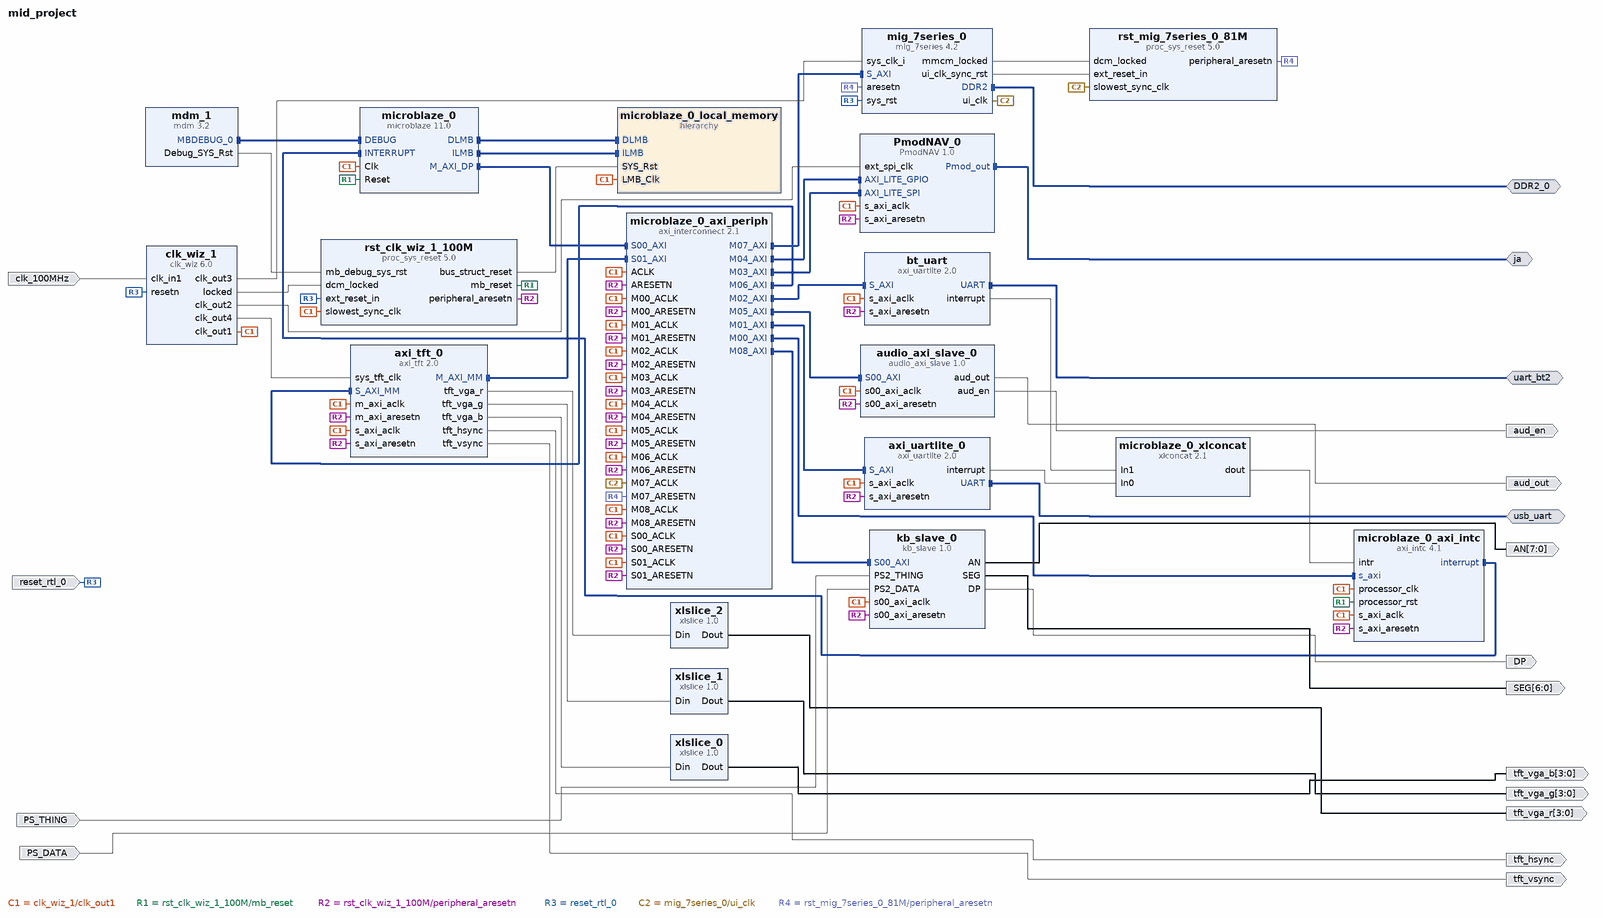
[diagram p0: block diagram of the top level]
# Vivado block design mid_project, xc7a100tcsg324-1, Vivado 2018.3
create_bd_design mid_project

create_bd_intf_port -mode Master -vlnv xilinx.com:interface:uart_rtl:1.0 usb_uart
create_bd_intf_port -mode Master -vlnv digilentinc.com:interface:pmod_rtl:1.0 ja
create_bd_intf_port -mode Master -vlnv xilinx.com:interface:uart_rtl:1.0 uart_bt2
create_bd_intf_port -mode Master -vlnv xilinx.com:interface:ddrx_rtl:1.0 DDR2_0
create_bd_port -dir I -type rst reset_rtl_0
set_property -dict {CONFIG.POLARITY ACTIVE_LOW} [get_bd_ports reset_rtl_0]
create_bd_port -dir I -type clk clk_100MHz
set_property -dict {CONFIG.FREQ_HZ 100000000 CONFIG.PHASE 0.000} [get_bd_ports clk_100MHz]
create_bd_port -dir O aud_out
create_bd_port -dir O aud_en
create_bd_port -dir O -from 3 -to 0 tft_vga_b
create_bd_port -dir O -from 3 -to 0 tft_vga_g
create_bd_port -dir O -from 3 -to 0 tft_vga_r
create_bd_port -dir O tft_hsync
create_bd_port -dir O tft_vsync
create_bd_port -dir I PS_THING
create_bd_port -dir I PS_DATA
create_bd_port -dir O -from 6 -to 0 SEG
create_bd_port -dir O -from 7 -to 0 AN
create_bd_port -dir O DP

create_bd_cell -type ip -vlnv xilinx.com:ip:microblaze:11.0 microblaze_0
set_property -dict {CONFIG.C_DEBUG_ENABLED 1 CONFIG.C_D_AXI 1 CONFIG.C_D_LMB 1 CONFIG.C_I_LMB 1} [get_bd_cells microblaze_0]
create_bd_cell -type hier microblaze_0_local_memory
create_bd_cell -type ip -vlnv xilinx.com:ip:axi_interconnect:2.1 microblaze_0_axi_periph
set_property -dict [list \
  CONFIG.M06_HAS_REGSLICE 3 \
  CONFIG.NUM_MI 9 \
  CONFIG.NUM_SI 2 \
  CONFIG.S00_HAS_REGSLICE 3 \
] [get_bd_cells microblaze_0_axi_periph]
create_bd_cell -type ip -vlnv xilinx.com:ip:axi_intc:4.1 microblaze_0_axi_intc
set_property -dict {CONFIG.C_HAS_FAST 1} [get_bd_cells microblaze_0_axi_intc]
create_bd_cell -type ip -vlnv xilinx.com:ip:xlconcat:2.1 microblaze_0_xlconcat
create_bd_cell -type ip -vlnv xilinx.com:ip:mdm:3.2 mdm_1
create_bd_cell -type ip -vlnv xilinx.com:ip:clk_wiz:6.0 clk_wiz_1
set_property -dict [list \
  CONFIG.CLKOUT2_JITTER 151.636 \
  CONFIG.CLKOUT2_PHASE_ERROR 98.575 \
  CONFIG.CLKOUT2_REQUESTED_OUT_FREQ 50 \
  CONFIG.CLKOUT2_USED true \
  CONFIG.CLKOUT3_JITTER 114.829 \
  CONFIG.CLKOUT3_PHASE_ERROR 98.575 \
  CONFIG.CLKOUT3_REQUESTED_OUT_FREQ 200 \
  CONFIG.CLKOUT3_USED true \
  CONFIG.CLKOUT4_JITTER 175.402 \
  CONFIG.CLKOUT4_PHASE_ERROR 98.575 \
  CONFIG.CLKOUT4_REQUESTED_OUT_FREQ 25 \
  CONFIG.CLKOUT4_USED true \
  CONFIG.CLK_IN1_BOARD_INTERFACE sys_clock \
  CONFIG.MMCM_CLKOUT1_DIVIDE 20 \
  CONFIG.MMCM_CLKOUT2_DIVIDE 5 \
  CONFIG.MMCM_CLKOUT3_DIVIDE 40 \
  CONFIG.MMCM_DIVCLK_DIVIDE 1 \
  CONFIG.NUM_OUT_CLKS 4 \
  CONFIG.PRIM_SOURCE Single_ended_clock_capable_pin \
  CONFIG.RESET_BOARD_INTERFACE reset \
  CONFIG.RESET_PORT resetn \
  CONFIG.RESET_TYPE ACTIVE_LOW \
  CONFIG.USE_BOARD_FLOW true \
] [get_bd_cells clk_wiz_1]
create_bd_cell -type ip -vlnv xilinx.com:ip:proc_sys_reset:5.0 rst_clk_wiz_1_100M
set_property -dict {CONFIG.RESET_BOARD_INTERFACE reset CONFIG.USE_BOARD_FLOW true} [get_bd_cells rst_clk_wiz_1_100M]
create_bd_cell -type ip -vlnv xilinx.com:ip:axi_uartlite:2.0 axi_uartlite_0
set_property -dict {CONFIG.UARTLITE_BOARD_INTERFACE usb_uart CONFIG.USE_BOARD_FLOW true} [get_bd_cells axi_uartlite_0]
create_bd_cell -type ip -vlnv digilentinc.com:IP:PmodNAV:1.0 PmodNAV_0
set_property -dict {CONFIG.PMOD ja CONFIG.USE_BOARD_FLOW true} [get_bd_cells PmodNAV_0]
create_bd_cell -type ip -vlnv xilinx.com:ip:axi_uartlite:2.0 bt_uart
set_property -dict {CONFIG.C_BAUDRATE 115200} [get_bd_cells bt_uart]
create_bd_cell -type ip -vlnv xilinx.com:ip:axi_tft:2.0 axi_tft_0
set_property -dict {CONFIG.C_EN_I2C_INTF 0 CONFIG.C_TFT_INTERFACE 0} [get_bd_cells axi_tft_0]
create_bd_cell -type ip -vlnv xilinx.com:ip:xlslice:1.0 xlslice_0
set_property -dict {CONFIG.DIN_FROM 5 CONFIG.DIN_TO 2 CONFIG.DIN_WIDTH 6 CONFIG.DOUT_WIDTH 4} [get_bd_cells xlslice_0]
create_bd_cell -type ip -vlnv xilinx.com:ip:xlslice:1.0 xlslice_1
set_property -dict {CONFIG.DIN_FROM 5 CONFIG.DIN_TO 2 CONFIG.DIN_WIDTH 6 CONFIG.DOUT_WIDTH 1} [get_bd_cells xlslice_1]
create_bd_cell -type ip -vlnv xilinx.com:ip:xlslice:1.0 xlslice_2
set_property -dict {CONFIG.DIN_FROM 5 CONFIG.DIN_TO 2 CONFIG.DIN_WIDTH 6 CONFIG.DOUT_WIDTH 1} [get_bd_cells xlslice_2]
create_bd_cell -type ip -vlnv xilinx.com:ip:mig_7series:4.2 mig_7series_0
create_bd_cell -type ip -vlnv xilinx.com:ip:proc_sys_reset:5.0 rst_mig_7series_0_81M
create_bd_cell -type ip -vlnv xilinx.com:user:kb_slave:1.0 kb_slave_0
create_bd_cell -type ip -vlnv utoronto.ca:user:audio_axi_slave:1.0 audio_axi_slave_0

# ---- hierarchy /microblaze_0_local_memory ----
current_bd_instance /microblaze_0_local_memory
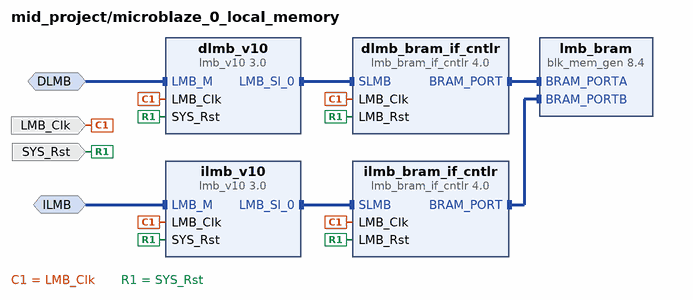
[diagram p1: block diagram inside /microblaze_0_local_memory]
create_bd_intf_pin -mode MirroredMaster -vlnv xilinx.com:interface:lmb_rtl:1.0 DLMB
create_bd_intf_pin -mode MirroredMaster -vlnv xilinx.com:interface:lmb_rtl:1.0 ILMB
create_bd_pin -dir I -type clk LMB_Clk
create_bd_pin -dir I -type rst SYS_Rst

create_bd_cell -type ip -vlnv xilinx.com:ip:lmb_v10:3.0 dlmb_v10
create_bd_cell -type ip -vlnv xilinx.com:ip:lmb_v10:3.0 ilmb_v10
create_bd_cell -type ip -vlnv xilinx.com:ip:lmb_bram_if_cntlr:4.0 dlmb_bram_if_cntlr
set_property -dict {CONFIG.C_ECC 0} [get_bd_cells dlmb_bram_if_cntlr]
create_bd_cell -type ip -vlnv xilinx.com:ip:lmb_bram_if_cntlr:4.0 ilmb_bram_if_cntlr
set_property -dict {CONFIG.C_ECC 0} [get_bd_cells ilmb_bram_if_cntlr]
create_bd_cell -type ip -vlnv xilinx.com:ip:blk_mem_gen:8.4 lmb_bram
set_property -dict {CONFIG.Memory_Type True_Dual_Port_RAM CONFIG.use_bram_block BRAM_Controller} [get_bd_cells lmb_bram]

# ---- connections ----

current_bd_instance /microblaze_0_local_memory
connect_bd_intf_net -intf_net microblaze_0_ilmb_bus [get_bd_intf_pins ilmb_v10/LMB_Sl_0] [get_bd_intf_pins ilmb_bram_if_cntlr/SLMB]
connect_bd_intf_net -intf_net microblaze_0_ilmb [get_bd_intf_pins ILMB] [get_bd_intf_pins ilmb_v10/LMB_M]
connect_bd_intf_net -intf_net microblaze_0_dlmb [get_bd_intf_pins DLMB] [get_bd_intf_pins dlmb_v10/LMB_M]
connect_bd_intf_net -intf_net microblaze_0_dlmb_cntlr [get_bd_intf_pins dlmb_bram_if_cntlr/BRAM_PORT] [get_bd_intf_pins lmb_bram/BRAM_PORTA]
connect_bd_intf_net -intf_net microblaze_0_dlmb_bus [get_bd_intf_pins dlmb_v10/LMB_Sl_0] [get_bd_intf_pins dlmb_bram_if_cntlr/SLMB]
connect_bd_intf_net -intf_net microblaze_0_ilmb_cntlr [get_bd_intf_pins ilmb_bram_if_cntlr/BRAM_PORT] [get_bd_intf_pins lmb_bram/BRAM_PORTB]
connect_bd_net -net microblaze_0_Clk [get_bd_pins LMB_Clk] \
  [get_bd_pins dlmb_v10/LMB_Clk] [get_bd_pins dlmb_bram_if_cntlr/LMB_Clk] [get_bd_pins ilmb_v10/LMB_Clk] \
  [get_bd_pins ilmb_bram_if_cntlr/LMB_Clk]
connect_bd_net [get_bd_pins SYS_Rst] \
  [get_bd_pins dlmb_v10/SYS_Rst] [get_bd_pins dlmb_bram_if_cntlr/LMB_Rst] [get_bd_pins ilmb_v10/SYS_Rst] \
  [get_bd_pins ilmb_bram_if_cntlr/LMB_Rst]
set_property HDL_ATTRIBUTE.BMM_INFO_ADDRESS_SPACE {byte  0x00000000 32 > mid_project microblaze_0_local_memory/lmb_bram} [get_bd_cells dlmb_bram_if_cntlr]
set_property HDL_ATTRIBUTE.KEEP_HIERARCHY yes [get_bd_cells dlmb_bram_if_cntlr]

current_bd_instance /
connect_bd_intf_net [get_bd_intf_pins microblaze_0_axi_periph/M02_AXI] [get_bd_intf_pins bt_uart/S_AXI]
connect_bd_intf_net [get_bd_intf_pins microblaze_0_axi_periph/M04_AXI] [get_bd_intf_pins PmodNAV_0/AXI_LITE_GPIO]
connect_bd_intf_net [get_bd_intf_pins axi_tft_0/M_AXI_MM] [get_bd_intf_pins microblaze_0_axi_periph/S01_AXI]
connect_bd_intf_net [get_bd_intf_pins microblaze_0_axi_periph/M05_AXI] [get_bd_intf_pins audio_axi_slave_0/S00_AXI]
connect_bd_intf_net -intf_net microblaze_0_intc_axi [get_bd_intf_pins microblaze_0_axi_periph/M00_AXI] [get_bd_intf_pins microblaze_0_axi_intc/s_axi]
connect_bd_intf_net [get_bd_intf_ports uart_bt2] [get_bd_intf_pins bt_uart/UART]
connect_bd_intf_net [get_bd_intf_pins microblaze_0/DLMB] [get_bd_intf_pins microblaze_0_local_memory/DLMB]
connect_bd_intf_net [get_bd_intf_pins mdm_1/MBDEBUG_0] [get_bd_intf_pins microblaze_0/DEBUG]
connect_bd_intf_net [get_bd_intf_ports usb_uart] [get_bd_intf_pins axi_uartlite_0/UART]
connect_bd_intf_net [get_bd_intf_pins microblaze_0/ILMB] [get_bd_intf_pins microblaze_0_local_memory/ILMB]
connect_bd_intf_net [get_bd_intf_pins microblaze_0_axi_periph/M03_AXI] [get_bd_intf_pins PmodNAV_0/AXI_LITE_SPI]
connect_bd_intf_net [get_bd_intf_pins microblaze_0_axi_periph/M08_AXI] [get_bd_intf_pins kb_slave_0/S00_AXI]
connect_bd_intf_net -intf_net microblaze_0_axi_dp [get_bd_intf_pins microblaze_0_axi_periph/S00_AXI] [get_bd_intf_pins microblaze_0/M_AXI_DP]
connect_bd_intf_net [get_bd_intf_pins microblaze_0_axi_periph/M01_AXI] [get_bd_intf_pins axi_uartlite_0/S_AXI]
connect_bd_intf_net [get_bd_intf_pins microblaze_0_axi_periph/M06_AXI] [get_bd_intf_pins axi_tft_0/S_AXI_MM]
connect_bd_intf_net [get_bd_intf_ports ja] [get_bd_intf_pins PmodNAV_0/Pmod_out]
connect_bd_intf_net [get_bd_intf_pins microblaze_0_axi_intc/interrupt] [get_bd_intf_pins microblaze_0/INTERRUPT]
connect_bd_intf_net [get_bd_intf_pins microblaze_0_axi_periph/M07_AXI] [get_bd_intf_pins mig_7series_0/S_AXI]
connect_bd_intf_net [get_bd_intf_ports DDR2_0] [get_bd_intf_pins mig_7series_0/DDR2]
connect_bd_net -net microblaze_0_intr [get_bd_pins microblaze_0_xlconcat/dout] [get_bd_pins microblaze_0_axi_intc/intr]
connect_bd_net -net microblaze_0_Clk [get_bd_pins clk_wiz_1/clk_out1] \
  [get_bd_pins microblaze_0/Clk] [get_bd_pins microblaze_0_axi_periph/ACLK] [get_bd_pins microblaze_0_axi_periph/S00_ACLK] \
  [get_bd_pins microblaze_0_axi_periph/M00_ACLK] [get_bd_pins microblaze_0_axi_intc/s_axi_aclk] \
  [get_bd_pins microblaze_0_axi_intc/processor_clk] [get_bd_pins microblaze_0_local_memory/LMB_Clk] \
  [get_bd_pins rst_clk_wiz_1_100M/slowest_sync_clk] [get_bd_pins axi_uartlite_0/s_axi_aclk] \
  [get_bd_pins microblaze_0_axi_periph/M01_ACLK] [get_bd_pins microblaze_0_axi_periph/M02_ACLK] \
  [get_bd_pins PmodNAV_0/s_axi_aclk] [get_bd_pins microblaze_0_axi_periph/M03_ACLK] \
  [get_bd_pins microblaze_0_axi_periph/M04_ACLK] [get_bd_pins bt_uart/s_axi_aclk] \
  [get_bd_pins microblaze_0_axi_periph/M05_ACLK] [get_bd_pins axi_tft_0/m_axi_aclk] [get_bd_pins axi_tft_0/s_axi_aclk] \
  [get_bd_pins microblaze_0_axi_periph/M06_ACLK] [get_bd_pins microblaze_0_axi_periph/S01_ACLK] \
  [get_bd_pins microblaze_0_axi_periph/M08_ACLK] [get_bd_pins kb_slave_0/s00_axi_aclk] \
  [get_bd_pins audio_axi_slave_0/s00_axi_aclk]
connect_bd_net [get_bd_pins clk_wiz_1/locked] [get_bd_pins rst_clk_wiz_1_100M/dcm_locked]
connect_bd_net [get_bd_pins rst_clk_wiz_1_100M/mb_reset] [get_bd_pins microblaze_0/Reset] [get_bd_pins microblaze_0_axi_intc/processor_rst]
connect_bd_net [get_bd_pins rst_clk_wiz_1_100M/bus_struct_reset] [get_bd_pins microblaze_0_local_memory/SYS_Rst]
connect_bd_net [get_bd_pins rst_clk_wiz_1_100M/peripheral_aresetn] \
  [get_bd_pins microblaze_0_axi_periph/ARESETN] [get_bd_pins microblaze_0_axi_periph/S00_ARESETN] \
  [get_bd_pins microblaze_0_axi_periph/M00_ARESETN] [get_bd_pins microblaze_0_axi_intc/s_axi_aresetn] \
  [get_bd_pins axi_uartlite_0/s_axi_aresetn] [get_bd_pins microblaze_0_axi_periph/M01_ARESETN] \
  [get_bd_pins microblaze_0_axi_periph/M02_ARESETN] [get_bd_pins PmodNAV_0/s_axi_aresetn] \
  [get_bd_pins microblaze_0_axi_periph/M03_ARESETN] [get_bd_pins microblaze_0_axi_periph/M04_ARESETN] \
  [get_bd_pins bt_uart/s_axi_aresetn] [get_bd_pins microblaze_0_axi_periph/M05_ARESETN] [get_bd_pins axi_tft_0/m_axi_aresetn] \
  [get_bd_pins axi_tft_0/s_axi_aresetn] [get_bd_pins microblaze_0_axi_periph/M06_ARESETN] \
  [get_bd_pins microblaze_0_axi_periph/S01_ARESETN] [get_bd_pins microblaze_0_axi_periph/M08_ARESETN] \
  [get_bd_pins kb_slave_0/s00_axi_aresetn] [get_bd_pins audio_axi_slave_0/s00_axi_aresetn]
connect_bd_net [get_bd_pins mdm_1/Debug_SYS_Rst] [get_bd_pins rst_clk_wiz_1_100M/mb_debug_sys_rst]
connect_bd_net -net sys_clock_1 [get_bd_ports clk_100MHz] [get_bd_pins clk_wiz_1/clk_in1]
connect_bd_net [get_bd_pins axi_uartlite_0/interrupt] [get_bd_pins microblaze_0_xlconcat/In0]
connect_bd_net [get_bd_pins clk_wiz_1/clk_out2] [get_bd_pins PmodNAV_0/ext_spi_clk]
connect_bd_net [get_bd_pins bt_uart/interrupt] [get_bd_pins microblaze_0_xlconcat/In1]
connect_bd_net [get_bd_pins audio_axi_slave_0/aud_out] [get_bd_ports aud_out]
connect_bd_net [get_bd_pins audio_axi_slave_0/aud_en] [get_bd_ports aud_en]
connect_bd_net [get_bd_pins xlslice_0/Dout] [get_bd_ports tft_vga_b]
connect_bd_net [get_bd_pins xlslice_1/Dout] [get_bd_ports tft_vga_g]
connect_bd_net [get_bd_pins axi_tft_0/tft_vga_b] [get_bd_pins xlslice_0/Din]
connect_bd_net [get_bd_pins axi_tft_0/tft_vga_g] [get_bd_pins xlslice_1/Din]
connect_bd_net [get_bd_pins axi_tft_0/tft_vga_r] [get_bd_pins xlslice_2/Din]
connect_bd_net [get_bd_pins xlslice_2/Dout] [get_bd_ports tft_vga_r]
connect_bd_net [get_bd_pins axi_tft_0/tft_hsync] [get_bd_ports tft_hsync]
connect_bd_net [get_bd_pins axi_tft_0/tft_vsync] [get_bd_ports tft_vsync]
connect_bd_net [get_bd_pins clk_wiz_1/clk_out4] [get_bd_pins axi_tft_0/sys_tft_clk]
connect_bd_net -net reset_1 [get_bd_ports reset_rtl_0] \
  [get_bd_pins clk_wiz_1/resetn] [get_bd_pins rst_clk_wiz_1_100M/ext_reset_in] [get_bd_pins mig_7series_0/sys_rst]
connect_bd_net [get_bd_pins clk_wiz_1/clk_out3] [get_bd_pins mig_7series_0/sys_clk_i]
connect_bd_net [get_bd_pins mig_7series_0/ui_clk] [get_bd_pins microblaze_0_axi_periph/M07_ACLK] [get_bd_pins rst_mig_7series_0_81M/slowest_sync_clk]
connect_bd_net [get_bd_pins mig_7series_0/mmcm_locked] [get_bd_pins rst_mig_7series_0_81M/dcm_locked]
connect_bd_net [get_bd_pins mig_7series_0/ui_clk_sync_rst] [get_bd_pins rst_mig_7series_0_81M/ext_reset_in]
connect_bd_net [get_bd_pins rst_mig_7series_0_81M/peripheral_aresetn] \
  [get_bd_pins mig_7series_0/aresetn] [get_bd_pins microblaze_0_axi_periph/M07_ARESETN]
connect_bd_net [get_bd_ports PS_THING] [get_bd_pins kb_slave_0/PS2_THING]
connect_bd_net [get_bd_ports PS_DATA] [get_bd_pins kb_slave_0/PS2_DATA]
connect_bd_net [get_bd_pins kb_slave_0/SEG] [get_bd_ports SEG]
connect_bd_net [get_bd_pins kb_slave_0/AN] [get_bd_ports AN]
connect_bd_net [get_bd_pins kb_slave_0/DP] [get_bd_ports DP]
set_property HDL_ATTRIBUTE.BMM_INFO_PROCESSOR {microblaze-le > mid_project microblaze_0_local_memory/dlmb_bram_if_cntlr} [get_bd_cells microblaze_0]
set_property HDL_ATTRIBUTE.KEEP_HIERARCHY yes [get_bd_cells microblaze_0]

# ---- address map ----
assign_bd_address -offset 0x80000000 -range 128M -target_address_space [get_bd_addr_spaces axi_tft_0/Video_data] [get_bd_addr_segs mig_7series_0/memmap/memaddr]
exclude_bd_addr_seg -offset 0x00080000 -range 64K -target_address_space [get_bd_addr_spaces axi_tft_0/Video_data] [get_bd_addr_segs PmodNAV_0/AXI_LITE_SPI/Reg0]
exclude_bd_addr_seg -offset 0x00090000 -range 4K -target_address_space [get_bd_addr_spaces axi_tft_0/Video_data] [get_bd_addr_segs PmodNAV_0/AXI_LITE_GPIO/Reg0]
exclude_bd_addr_seg -offset 0x40600000 -range 64K -target_address_space [get_bd_addr_spaces axi_tft_0/Video_data] [get_bd_addr_segs axi_uartlite_0/S_AXI/Reg]
exclude_bd_addr_seg -offset 0x40610000 -range 64K -target_address_space [get_bd_addr_spaces axi_tft_0/Video_data] [get_bd_addr_segs bt_uart/S_AXI/Reg]
exclude_bd_addr_seg -offset 0x41200000 -range 64K -target_address_space [get_bd_addr_spaces axi_tft_0/Video_data] [get_bd_addr_segs microblaze_0_axi_intc/S_AXI/Reg]
exclude_bd_addr_seg -offset 0x44A00000 -range 64K -target_address_space [get_bd_addr_spaces axi_tft_0/Video_data] [get_bd_addr_segs audio_axi_slave_0/S00_AXI/S00_AXI_reg]
exclude_bd_addr_seg -offset 0x44A10000 -range 64K -target_address_space [get_bd_addr_spaces axi_tft_0/Video_data] [get_bd_addr_segs axi_tft_0/S_AXI_MM/Reg]
exclude_bd_addr_seg -offset 0x44A20000 -range 64K -target_address_space [get_bd_addr_spaces axi_tft_0/Video_data] [get_bd_addr_segs kb_slave_0/S00_AXI/S00_AXI_reg]
assign_bd_address -offset 0x00000000 -range 512K -target_address_space [get_bd_addr_spaces microblaze_0/Data] [get_bd_addr_segs microblaze_0_local_memory/dlmb_bram_if_cntlr/SLMB/Mem]
assign_bd_address -offset 0x00080000 -range 64K -target_address_space [get_bd_addr_spaces microblaze_0/Data] [get_bd_addr_segs PmodNAV_0/AXI_LITE_SPI/Reg0]
assign_bd_address -offset 0x00090000 -range 4K -target_address_space [get_bd_addr_spaces microblaze_0/Data] [get_bd_addr_segs PmodNAV_0/AXI_LITE_GPIO/Reg0]
assign_bd_address -offset 0x40600000 -range 64K -target_address_space [get_bd_addr_spaces microblaze_0/Data] [get_bd_addr_segs axi_uartlite_0/S_AXI/Reg]
assign_bd_address -offset 0x40610000 -range 64K -target_address_space [get_bd_addr_spaces microblaze_0/Data] [get_bd_addr_segs bt_uart/S_AXI/Reg]
assign_bd_address -offset 0x41200000 -range 64K -target_address_space [get_bd_addr_spaces microblaze_0/Data] [get_bd_addr_segs microblaze_0_axi_intc/S_AXI/Reg]
assign_bd_address -offset 0x44A00000 -range 64K -target_address_space [get_bd_addr_spaces microblaze_0/Data] [get_bd_addr_segs audio_axi_slave_0/S00_AXI/S00_AXI_reg]
assign_bd_address -offset 0x44A10000 -range 64K -target_address_space [get_bd_addr_spaces microblaze_0/Data] [get_bd_addr_segs axi_tft_0/S_AXI_MM/Reg]
assign_bd_address -offset 0x44A20000 -range 64K -target_address_space [get_bd_addr_spaces microblaze_0/Data] [get_bd_addr_segs kb_slave_0/S00_AXI/S00_AXI_reg]
assign_bd_address -offset 0x80000000 -range 128M -target_address_space [get_bd_addr_spaces microblaze_0/Data] [get_bd_addr_segs mig_7series_0/memmap/memaddr]
assign_bd_address -offset 0x00000000 -range 512K -target_address_space [get_bd_addr_spaces microblaze_0/Instruction] [get_bd_addr_segs microblaze_0_local_memory/ilmb_bram_if_cntlr/SLMB/Mem]

validate_bd_design
save_bd_design
